# Altium project STM32Ethernet.PrjPcb
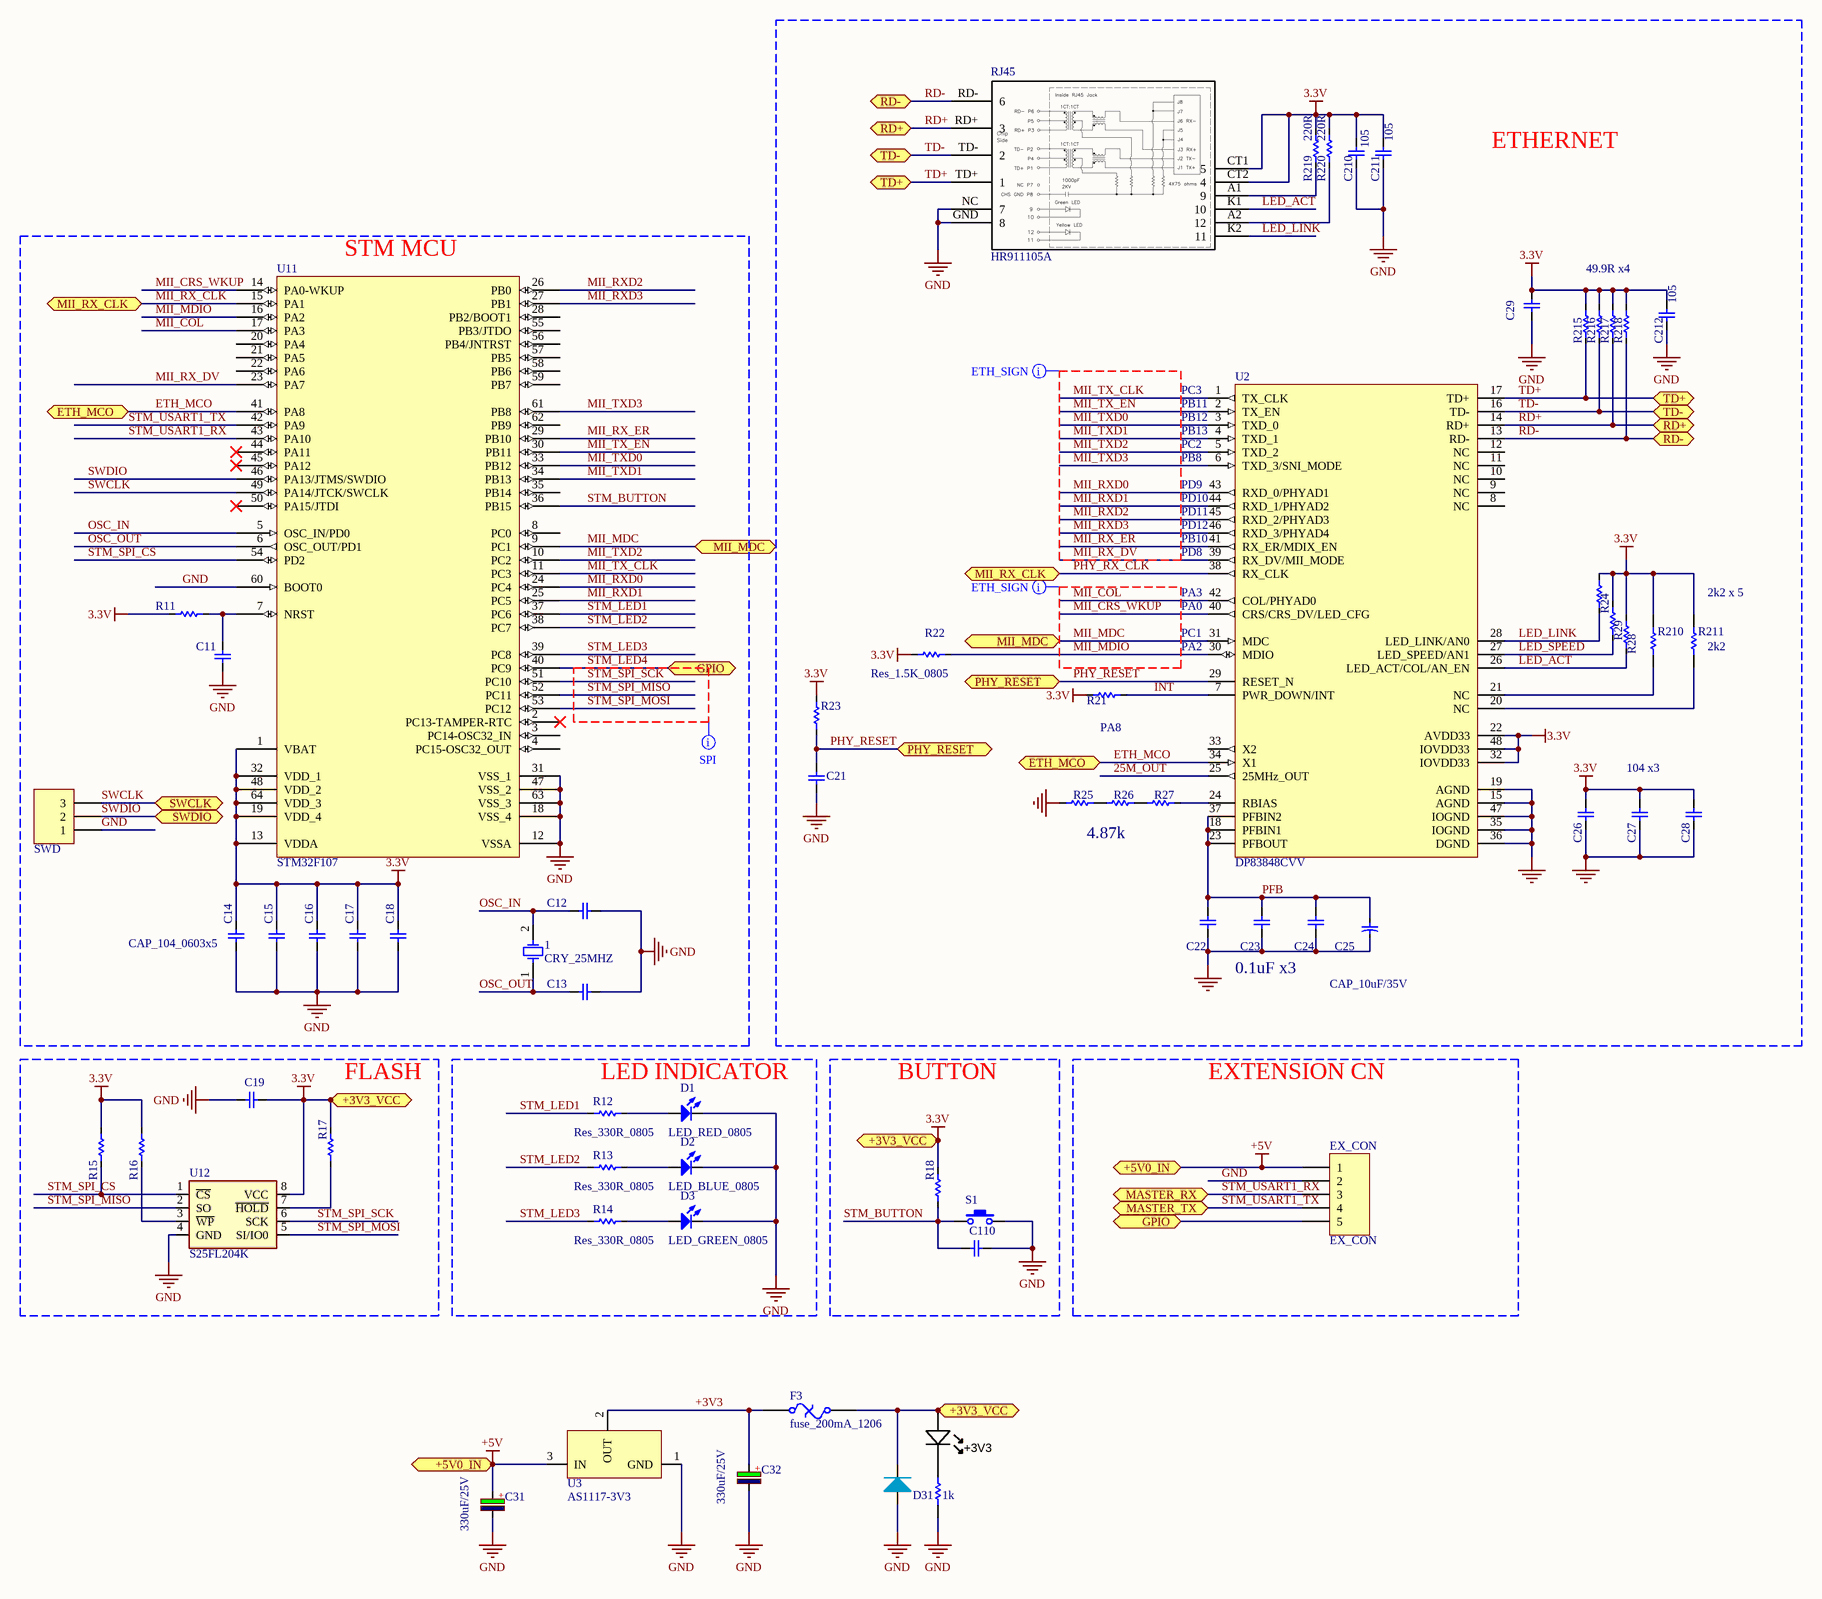
[diagram p0: STM32Ethernet.SchDoc]
1 sheet, 65 parts. Net scope: flat (ports and power ports of the same name join across sheets).
Board file: STM32Ethernet.PcbDoc

## Sheet STM32Ethernet.SchDoc
size A2

### Parts
1  CRY_25MHZ  [cry]
+3V3  Blue  [LED-0805-K]  (value not drawn)
C11  CAP_102_0603  [CAP_0805_TOP]  (value not drawn)
C12  CAP_18pF_0603  [CAP_0603_TOP]  (value not drawn)
C13  CAP_18pF_0603  [CAP_0603_TOP]  (value not drawn)
C14  CAP_104_0603  [CAPC1608N_F]  (value not drawn)
C15  CAP_104_0603  [CAPC1608N_F]  (value not drawn)
C16  CAP_104_0603  [CAPC1608N_F]  (value not drawn)
C17  CAP_104_0603  [CAPC1608N_F]  (value not drawn)
C18  CAP_104_0603  [CAPC1608N_F]  (value not drawn)
C19  CAP_104_0603  [CAP_0805_TOP]  (value not drawn)
C21  CAP_102_0603  [CAPC1608N_F]  (value not drawn)
C22  CAP_104_0603  [CAPC1608N_F]  (value not drawn)
C23  CAP_104_0603  [CAPC1608N_F]  (value not drawn)
C24  CAP_104_0603  [CAPC1608N_F]  (value not drawn)
C25  CAP_10uF/35V  [CAP_10uF/35V]
C26  CAP_104_0603  [CAPC1608N_F]  (value not drawn)
C27  CAP_104_0603  [CAPC1608N_F]  (value not drawn)
C28  CAP_104_0603  [CAPC1608N_F]  (value not drawn)
C29  CAP_104_0603  [CAPC2012N_F]  (value not drawn)
C31  330uF/25V  [CAPMP3528X210N]
C32  330uF/25V  [CAPMP3528X210N]
C110  CAP_102_0603  [CAP_0805_TOP]  (value not drawn)
C210  105  [CAPC1608N_F]
C211  105  [CAPC1608N_F]
C212  105  [CAPC2012N_F]
D1  LED_RED_0805  [LED 0805 TOP]
D2  LED_BLUE_0805  [LED 0805 TOP]
D3  LED_GREEN_0805  [LED 0805 TOP]
D31  Diode  [DO-214AC]  (value not drawn)
EX_CON  EX_CON  [HDR1X5]
F3  fuse_200mA_1206  [SMD 1206]
R11  Res_4.7K_0805  [RES_0805_TOP]  (value not drawn)
R12  Res_330R_0805  [RES_0805_TOP]
R13  Res_330R_0805  [RES_0805_TOP]
R14  Res_330R_0805  [RES_0805_TOP]
R15  Res_4.7K_0805  [RES_0805_TOP]  (value not drawn)
R16  Res_4.7K_0805  [RES_0805_TOP]  (value not drawn)
R17  Res_4.7K_0805  [RES_0805_TOP]  (value not drawn)
R18  Res_4.7K_0805  [RES_0805_TOP]  (value not drawn)
R21  Res_2.2K_0805  [RESC1608N_F]  (value not drawn)
R22  Res_1.5K_0805  [RESC1608N_F]
R23  Res_4.7K_0805  [RESC1608N_F]  (value not drawn)
R24  Res_2.2K_0805  [RESC1608N_F]  (value not drawn)
R25  Res_47R_0805  [RES_0805_TOP]  (value not drawn)
R26  Res_120R_0805  [RES_0805_TOP]  (value not drawn)
R27  Res_4.7K_0805  [RES_0805_TOP]  (value not drawn)
R28  Res_0R_0603  [RESC1608N_F]  (value not drawn)
R29  Res_0R_0603  [RESC1608N_F]  (value not drawn)
R210  2k2  [RESC1608N_F]  (value not drawn)
R211  2k2  [RESC1608N_F]
R215  Res_49.9R_0805  [RES_0805_TOP]  (value not drawn)
R216  Res_49.9R_0805  [RES_0805_TOP]  (value not drawn)
R217  Res_49.9R_0805  [RES_0805_TOP]  (value not drawn)
R218  Res_49.9R_0805  [RES_0805_TOP]  (value not drawn)
R219  220R  [RESC1608N_F]
R220  220R  [RESC1608N_F]
RJ45  HR911105A  [HR911105A]
Rled  value 1k  [RESC2012N_F]  (hidden comment: Res_0805_1k)
S1  BUTTON 2P  [Nut nhan 2 chan  dung]  (value not drawn)
SWD  Header 3  [HDR1X3]  (value not drawn)
U2  DP83848CVV  [LQFP48]
U3  AS1117-3V3  [SOT223-4N]
U11  STM32F107  [LQFP64_N]
U12  S25FL204K  [SOIC_8]

### Ports
+3V3_VCC, +5V0_IN, ETH_MCO, GPIO, MASTER_RX, MASTER_TX, MII_MDC, MII_RX_CLK, PHY_RESET, RD+, RD-, SWCLK, SWDIO, TD+, TD-

### Nets
3.3V: +3V3.A C14.1 C15.1 C16.1 C17.1 C18.1 C19.1 C26.2 C27.1 C28.2 C29.1 C210.1 C211.1 C212.1 D31.2(K) F3.2 R11.2 R15.1 R16.1 R17.1 R18.1 R21.2 R22.1 R23.2 R24.2 R28.1 R29.2 R210.2 R211.2 R215.1 R216.1 R217.1 R218.1 R219.1 R220.1 RJ45.CT1(5) RJ45.CT2(4) U2.22(AVDD33) U2.32(IOVDD33) U2.48(IOVDD33) U11.1(VBAT) U11.13(VDDA) U11.19(VDD_4) U11.32(VDD_1) U11.48(VDD_2) U11.64(VDD_3) U12.8(VCC) ; port +3V3_VCC
+5V: C31.1 EX_CON.1 U3.3(IN) ; port +5V0_IN
GND: C11.2 C12.2 C13.2 C14.2 C15.2 C16.2 C17.2 C18.2 C19.2 C21.1 C22.1 C23.1 C24.1 C25.2 C26.1 C27.2 C28.1 C29.2 C31.2 C32.2 C110.2 C210.2 C211.2 C212.2 D1.2(K) D2.2(K) D3.2(K) D31.1(A) EX_CON.2 R25.2 RJ45.GND(8) RJ45.NC(7) Rled.2 S1.2 SWD.1 U2.15(AGND) U2.19(AGND) U2.35(IOGND) U2.36(DGND) U2.47(IOGND) U3.1(GND) U11.12(VSSA) U11.18(VSS_4) U11.31(VSS_1) U11.47(VSS_2) U11.60(BOOT0) U11.63(VSS_3) U12.4(GND)
25M_OUT: U2.25(25MHz_OUT)
+3V3: C32.1 F3.1 U3.2(OUT)
ETH_MCO: U2.34(X1) U11.41(PA8) ; port ETH_MCO
INT: R21.1 U2.7(PWR_DOWN/INT)
LED_ACT: R28.2 RJ45.K1(10) U2.26(LED_ACT/COL/AN_EN)
LED_LINK: R24.1 RJ45.K2(11) U2.28(LED_LINK/AN0)
LED_SPEED: R29.1 U2.27(LED_SPEED/AN1)
MII_COL: U2.42(COL/PHYAD0) U11.17(PA3)
MII_CRS_WKUP: U2.40(CRS/CRS_DV/LED_CFG) U11.14(PA0-WKUP)
MII_MDC: U2.31(MDC) U11.9(PC1) ; port MII_MDC
MII_MDIO: R22.2 U2.30(MDIO) U11.16(PA2)
MII_RX_CLK: U2.38(RX_CLK) U11.15(PA1) ; port MII_RX_CLK  [also labelled PHY_RX_CLK]
MII_RX_DV: U2.39(RX_DV/MII_MODE) U11.23(PA7)
MII_RX_ER: U2.41(RX_ER/MDIX_EN) U11.29(PB10)
MII_RXD0: U2.43(RXD_0/PHYAD1) U11.24(PC4)
MII_RXD1: U2.44(RXD_1/PHYAD2) U11.25(PC5)
MII_RXD2: U2.45(RXD_2/PHYAD3) U11.26(PB0)
MII_RXD3: U2.46(RXD_3/PHYAD4) U11.27(PB1)
MII_TX_CLK: U2.1(TX_CLK) U11.11(PC3)
MII_TX_EN: U2.2(TX_EN) U11.30(PB11)
MII_TXD0: U2.3(TXD_0) U11.33(PB12)
MII_TXD1: U2.4(TXD_1) U11.34(PB13)
MII_TXD2: U2.5(TXD_2) U11.10(PC2)
MII_TXD3: U2.6(TXD_3/SNI_MODE) U11.61(PB8)
OSC_IN: 1.2(OSC2) C12.1 U11.5(OSC_IN/PD0)
OSC_OUT: 1.1(OSC1) C13.1 U11.6(OSC_OUT/PD1)
PFB: C22.2 C23.2 C24.2 C25.1 U2.18(PFBIN1) U2.23(PFBOUT) U2.37(PFBIN2)
PHY_RESET: C21.2 R23.1 U2.29(RESET_N) ; port PHY_RESET
RD+: R217.2 RJ45.RD+(3) U2.14(RD+) ; port RD+
RD-: R218.2 RJ45.RD-(6) U2.13(RD-) ; port RD-
STM_BUTTON: C110.1 R18.2 S1.1 U11.36(PB15)
STM_LED1: R12.1 U11.37(PC6)
STM_LED2: R13.1 U11.38(PC7)
STM_LED3: R14.1 U11.39(PC8)
STM_LED4: EX_CON.5 U11.40(PC9) ; port GPIO
STM_SPI_CS: R15.2 U11.54(PD2) U12.1(~{CS})
STM_SPI_MISO: U11.52(PC11) U12.2(SO)
STM_SPI_MOSI: U11.53(PC12) U12.5(SI/IO0)
STM_SPI_SCK: U11.51(PC10) U12.6(SCK)
STM_USART1_RX: EX_CON.3 U11.43(PA10) ; port MASTER_RX
STM_USART1_TX: EX_CON.4 U11.42(PA9) ; port MASTER_TX
SWCLK: SWD.3 U11.49(PA14/JTCK/SWCLK) ; port SWCLK
SWDIO: SWD.2 U11.46(PA13/JTMS/SWDIO) ; port SWDIO
TD+: R215.2 RJ45.TD+(1) U2.17(TD+) ; port TD+
TD-: R216.2 RJ45.TD-(2) U2.16(TD-) ; port TD-
Net+3V3_K: +3V3.K Rled.1
NetC11_1: C11.1 R11.1 U11.7(NRST)
NetD1_1: D1.1(A) R12.2
NetD2_1: D2.1(A) R13.2
NetD3_1: D3.1(A) R14.2
NetR16_2: R16.2 U12.3(~{WP})
NetR17_2: R17.2 U12.7(~{HOLD})
NetR25_1: R25.1 R26.1
NetR26_2: R26.2 R27.2
NetR27_1: R27.1 U2.24(RBIAS)
NetR210_1: R210.1 U2.21(NC)
NetR211_1: R211.1 U2.20(NC)
NetR219_2: R219.2 RJ45.A1(9)
NetR220_2: R220.2 RJ45.A2(12)

Not connected (* = marked no-connect by the designer): U2 8(NC) 9(NC) 10(NC) 11(NC) 12(NC) 33(X2); U11 2(PC13-TAMPER-RTC)* 3(PC14-OSC32_IN) 4(PC15-OSC32_OUT) 8(PC0) 20(PA4) 21(PA5) 22(PA6) 28(PB2/BOOT1) 35(PB14) 44(PA11)* 45(PA12)* 50(PA15/JTDI)* 55(PB3/JTDO) 56(PB4/JNTRST) 57(PB5) 58(PB6) 59(PB7) 62(PB9)

### Layout directives
net class ETH_SIGN: MII_COL, MII_CRS_WKUP, MII_MDC, MII_MDIO, MII_RX_DV, MII_RX_ER, MII_RXD0, MII_RXD1, MII_RXD2, MII_RXD3, MII_TX_CLK, MII_TX_EN, MII_TXD0, MII_TXD1, MII_TXD2, MII_TXD3
net class SPI_DATA: STM_LED4, STM_SPI_MISO, STM_SPI_MOSI, STM_SPI_SCK

### Notes on the sheet
- ETHERNET
- (near U11) STM MCU
- 49.9R x4
- (near U2) PC3
- (near U2) PB11
- (near U2) PB12
- (near U2) PB13
- (near U2) PC2
- (near U2) PB8
- (near U2) PD9
- (near U2) PD10
- (near U2) PD11
- (near U2) PD12
- (near U2) PB10
- (near U2) PD8
- (near U2) PA3
- (near U2) PA0
- (near R211) 2k2 x 5
- (near U2) PC1
- (near U2) PA2
- (near R21) PA8
- 104 x3
- 4.87k
- (near C14) CAP_104_0603x5
- 0.1uF x3
- (near R17) FLASH
- LED INDICATOR
- BUTTON
- EXTENSION CN
- (in symbol CP4) +

### Library data of the parts
1 = cry: Crystal Oscillator; Published: 8-Jun-2000; LatestRevisionDate: 17-Jul-2002; LatestRevisionNote: Re-released for DXP Platform.; PackageReference: R38; Publisher: Altium Limited
+3V3 = LED_SMD_Blue_0805_100mcd: LED 0805 SMD Blue 100mcd 470nm; Manufacturer 1: Ligitek; Manufacturer Part Number 1: LG-170DBKZ-CT; Ratings: 100 mcd; 470 nm; Package / Case: 0805; Material: InGaN/GaN; Value: Blue; Color: Blue
C11-C19 C21-C24 C26-C29 C110 C210-C212 = Cap 1206 BUT: Capacitor; Value: 104; Published: 8-Jun-2000; LatestRevisionDate: 17-Jul-2002; LatestRevisionNote: Re-released for DXP Platform.; PackageReference: RAD-0.3; Publisher: Altium Limited
C25 = CAP P: Value: CAP_220uF/6.3V; Published: 23-Sep-2002; PackageReference: CAPR5-4X5; Publisher: Altium Limited
C31 C32 = CP4: Cap 1000uF/16V - 220uF/50V; Description 5: 4,7uF>10uF/250V_3,3uF>10uF/400V - 2,2uF>4,7uF/450V; Description 1: 2200uF-3300uF/6,3V - 1000uF-2200uF/10V; Description 2: 1000uF/16V - 470uF => 1000uF/25V - 100uF/100V; Description 3: 330uF>470uF/35V_220uF>470uF/50V_10uF>22uF/250V; Description 4: 220uF => 330uF/63V - 10uF =>33uF/160 - 200V; Value: 1000uF/16V
D1-D3 = LED 0805 TOP: Typical INFRARED GaAs LED; Published: 8-Jun-2000; LatestRevisionDate: 08-Jul-2005; LatestRevisionNote: Mech Layer 1 removed.; PackageReference: LED-0; Publisher: Altium Limited; PackageDescription: LED; 2 Leads
D31 = Diode: pin to pad: 1>A 2>K
EX_CON = Header 5: Header, 5-Pin; LatestRevisionDate: 17-Jul-2002; LatestRevisionNote: Re-released for DXP Platform.; Publisher: Altium Limited
F3 = Fuse Thermal: Thermal Fuse; Published: 24-Mar-1999; LatestRevisionDate: 17-Jul-2002; LatestRevisionNote: Re-released for DXP Platform.; PackageReference: PIN-W2/E2.8; Publisher: Altium Limited; PackageDescription: Thru-Hole; 2 Leads
R11-R18 R21-R29 R215-R220 = Res: Resistor; Published: 8-Jun-2000; LatestRevisionDate: 17-Jul-2002; LatestRevisionNote: Re-released for DXP Platform.; PackageReference: AXIAL-0.3; Publisher: Altium Limited
R210 R211 = Res: Value: 10k
RJ45 = RJ45-LED: pin to pad: A1>12 A2>9 CT1>4 CT2>5 GND>8 K1>11 K2>10 NC>7 RD+>3 RD->6 TD+>1 TD->2
Rled = Res
S1 = BUTTON 2P: Switch; Published: 24-Mar-1999; LatestRevisionDate: 17-Jul-2002; LatestRevisionNote: Re-released for DXP Platform.; PackageReference: SPST-2; Publisher: Altium Limited
SWD = Header 3: Header, 3-Pin; LatestRevisionDate: 17-Jul-2002; LatestRevisionNote: Re-released for DXP Platform.; Publisher: Altium Limited
U3 = AS1117: pin to pad: 2>2+4
U11 = STM32F103RBT6: STM32 ARM-based 32-bit MCU with 128 Kbytes Flash, 64-pin LQFP, Industrial Temperature; Published: 30-May-2008; DatasheetVersion: rev6, Mar-2008; PackageVersion: Mar-2008; PackageReference: LQFP64; Publisher: Altium Limited; PackageDescription: 64-Pin Low-Profile Quad Flat Pack, 10 x 10 mm Body, 0.5 mm Pitch (LQFP64); ComponentLink1Description: Manufacturer Link; ComponentLink1URL: www.st.com/stm32; ComponentLink2Description: Datasheet; ComponentLink2URL: http://www.st.com/stonline/products/literature/ds/13587.pdf